# Altium schematic sheet P14 Hi3519 Peripheral.SchDoc
size 420 x 297 mm
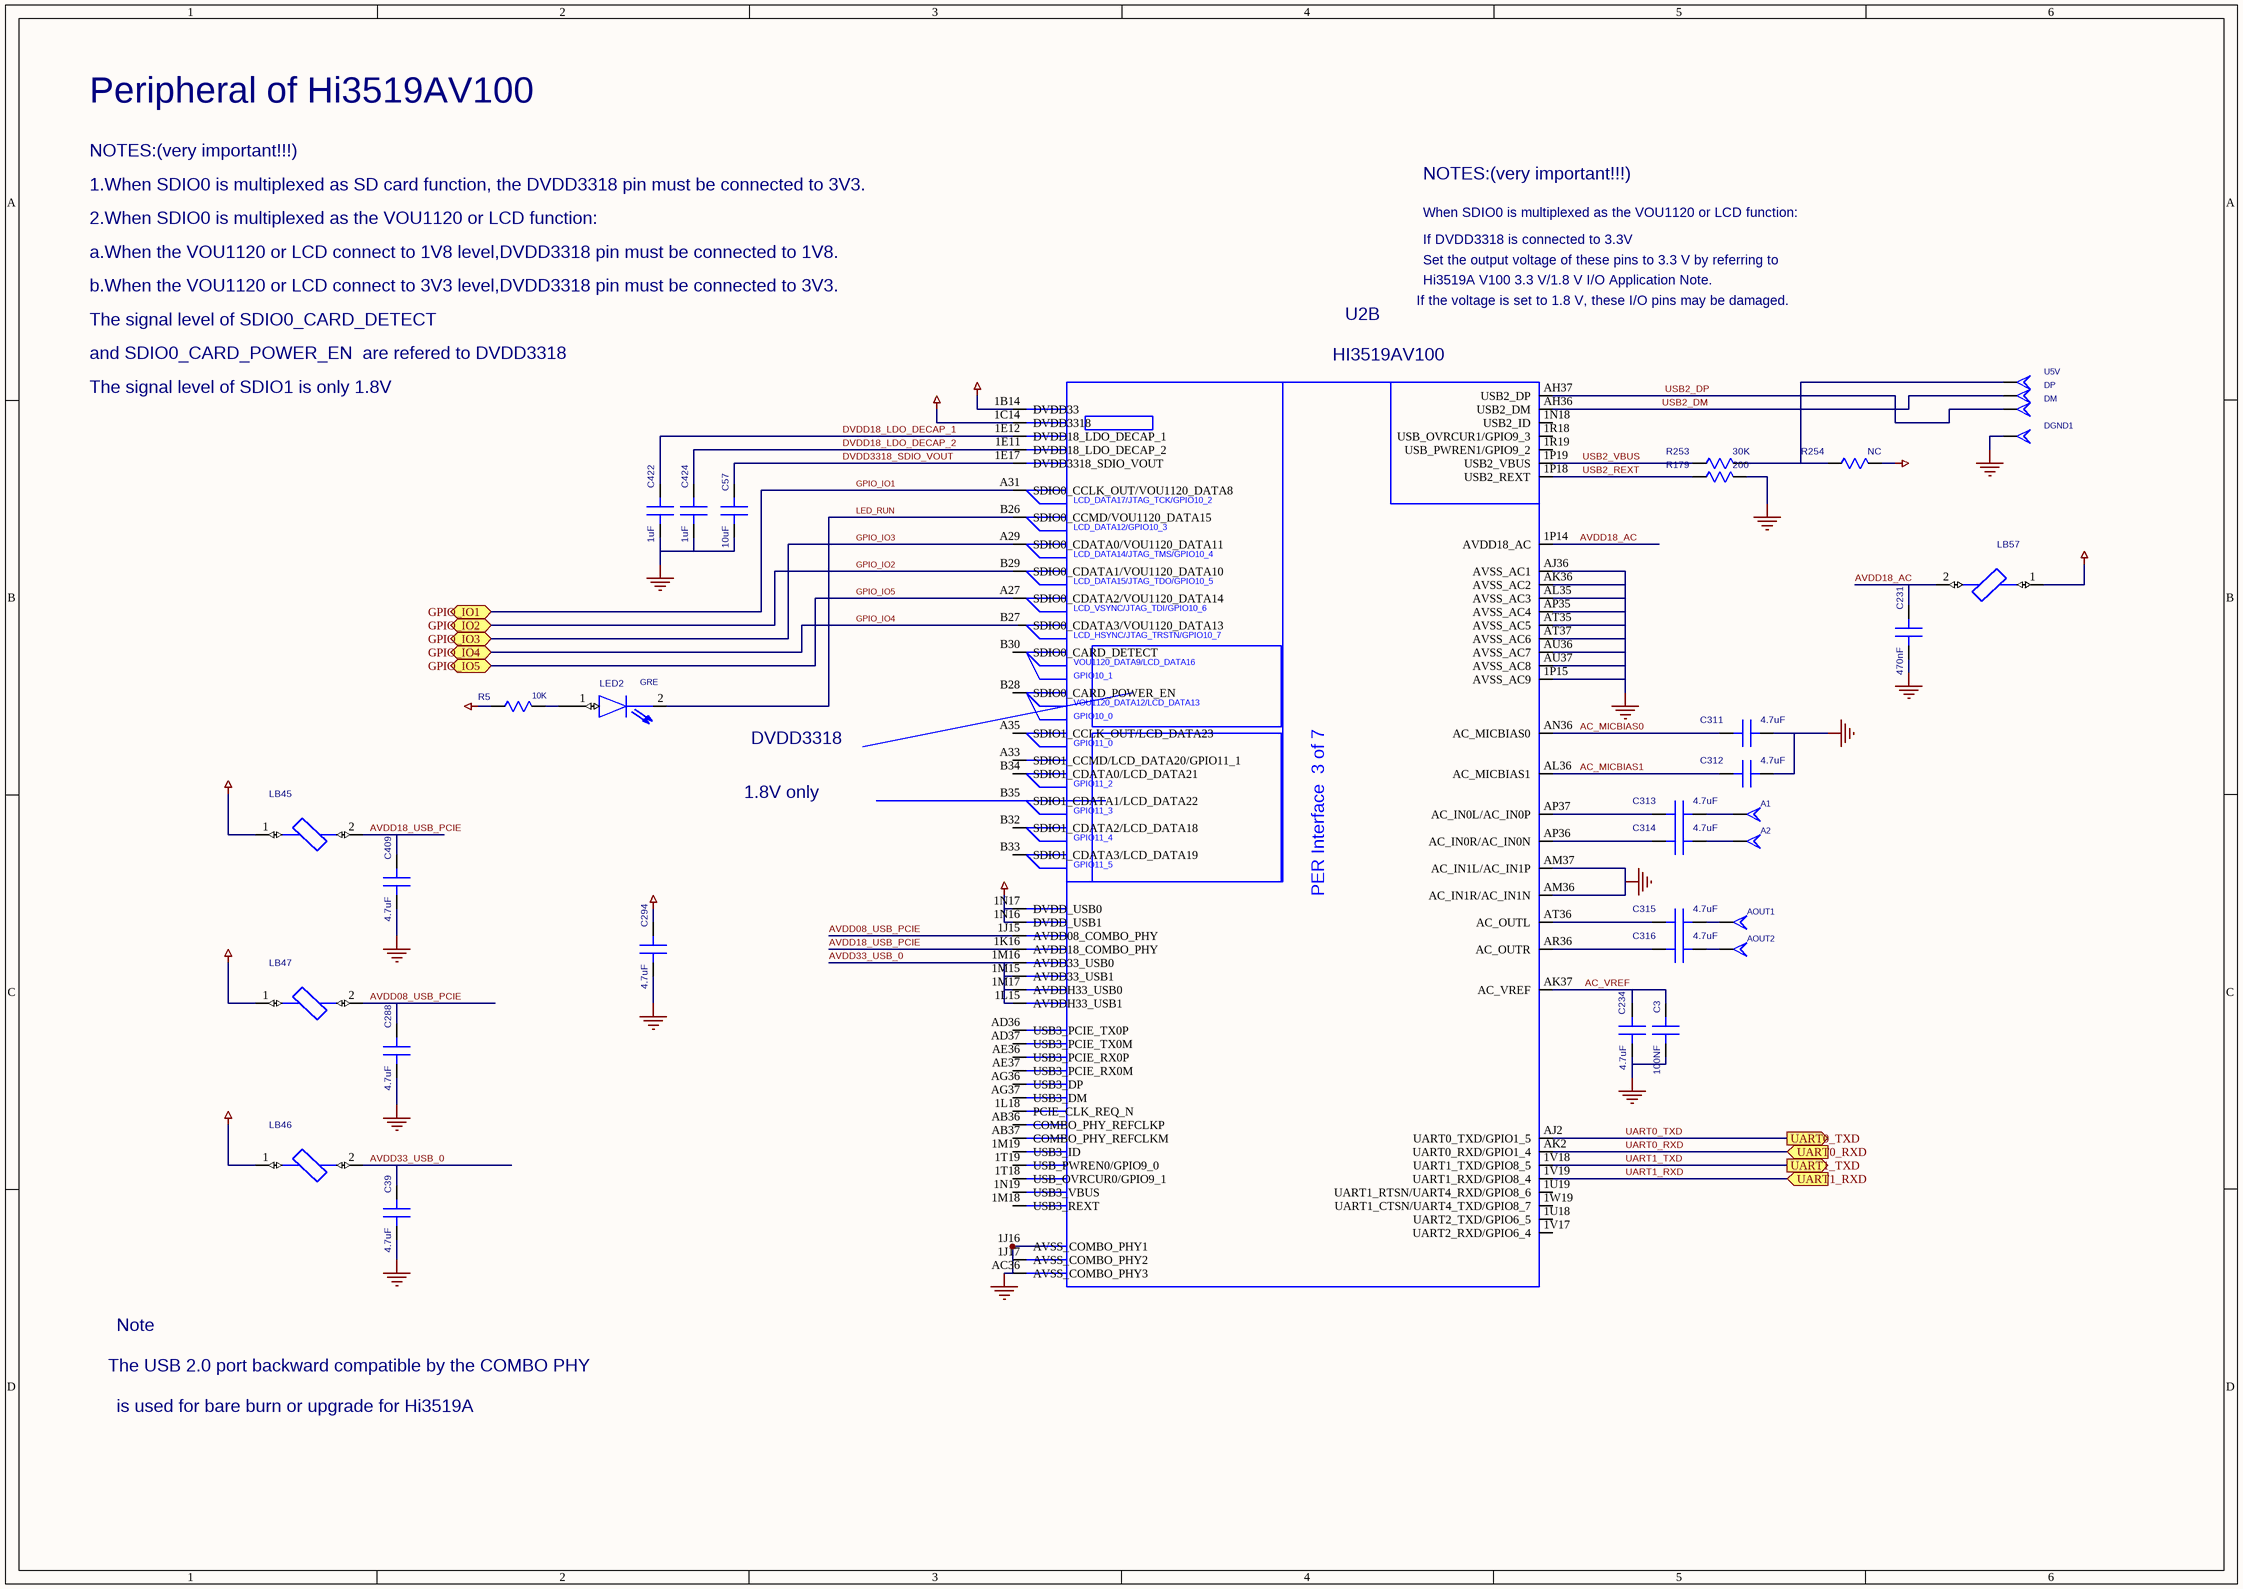
[diagram p0: P14 Hi3519 Peripheral.SchDoc]

## Parts
A1  T POINT A  [PAD]  (value not drawn)
A2  T POINT A  [PAD]  (value not drawn)
AOUT1  T POINT A  [PAD]  (value not drawn)
AOUT2  T POINT A  [PAD]  (value not drawn)
C3  100NF  [SC0402-BGA]
C39  4.7uF  [SC0402-BGA]
C57  10uF  [SC0603]
C231  470nF  [SC0402-BGA]
C234  4.7uF  [SC0402-BGA]
C288  4.7uF  [SC0402-BGA]
C294  4.7uF  [SC0402-BGA]
C311  4.7uF  [SC0402-BGA]
C312  4.7uF  [SC0402-BGA]
C313  4.7uF  [SC0402-BGA]
C314  4.7uF  [SC0402-BGA]
C315  4.7uF  [SC0402-BGA]
C316  4.7uF  [SC0402-BGA]
C409  4.7uF  [SC0402-BGA]
C422  1uF  [SC0402-BGA]
C424  1uF  [SC0402-BGA]
DGND1  T POINT A  [PAD]  (value not drawn)
DM  T POINT A  [PAD]  (value not drawn)
DP  T POINT A  [PAD]  (value not drawn)
LB45  LB  [SL0402]  (value not drawn)
LB46  LB  [SL0402]  (value not drawn)
LB47  LB  [SL0402]  (value not drawn)
LB57  LB  [SL0402]  (value not drawn)
LED2  GRE  [HSD0603-LED]
R5  10K  [SR0603]
R179  200  [SR0402]
R253  30K  [SR0402]
R254  NC  [SR0402]
U2  DEVICE: HI3519AV100  [HBGA567-16-3737]  (hidden comment: HI3519A_VO)  (part B of 7)
U5V  T POINT A  [PAD]  (value not drawn)

## Ports
GPIO_IO1, GPIO_IO2, GPIO_IO3, GPIO_IO4, GPIO_IO5, UART0_RXD, UART0_TXD, UART1_RXD, UART1_TXD

## Nets
0V8_LDO: LB47.1
1V8: LB45.1 LB57.1
3V3: LB46.1 R5.1(A) R254.2(B) U2.1B14(DVDD33) U2.1C14(DVDD3318)
DVDD: C294.1(A) U2.1N16(DVDD_USB1) U2.1N17(DVDD_USB0)
GND: C3.2(B) C39.2(B) C57.2(B) C231.2(B) C234.2(B) C288.2(B) C294.2(B) C311.2(B) C312.2(B) C409.2(B) C422.2(B) C424.2(B) DGND1.1(TP) R179.2(B) U2.1J16(AVSS_COMBO_PHY1) U2.1J17(AVSS_COMBO_PHY2) U2.1P15(AVSS_AC9) U2.AC36(AVSS_COMBO_PHY3) U2.AJ36(AVSS_AC1) U2.AK36(AVSS_AC2) U2.AL35(AVSS_AC3) U2.AM36(AC_IN1R/AC_IN1N) U2.AM37(AC_IN1L/AC_IN1P) U2.AP35(AVSS_AC4) U2.AT35(AVSS_AC5) U2.AT37(AVSS_AC6) U2.AU36(AVSS_AC7) U2.AU37(AVSS_AC8)
AC_MICBIAS0: C311.1(A) U2.AN36(AC_MICBIAS0)
AC_MICBIAS1: C312.1(A) U2.AL36(AC_MICBIAS1)
AC_VREF: C3.1(A) C234.1(A) U2.AK37(AC_VREF)
AVDD08_USB_PCIE: C288.1(A) LB47.2 U2.1J15(AVDD08_COMBO_PHY)
AVDD18_AC: C231.1(A) LB57.2 U2.1P14(AVDD18_AC)
AVDD18_USB_PCIE: C409.1(A) LB45.2 U2.1K16(AVDD18_COMBO_PHY)
AVDD33_USB_0: C39.1(A) LB46.2 U2.1L15(AVDDH33_USB1) U2.1M15(AVDD33_USB1) U2.1M16(AVDD33_USB0) U2.1M17(AVDDH33_USB0)
DVDD18_LDO_DECAP_1: C422.1(A) U2.1E12(DVDD18_LDO_DECAP_1)
DVDD18_LDO_DECAP_2: C424.1(A) U2.1E11(DVDD18_LDO_DECAP_2)
DVDD3318_SDIO_VOUT: C57.1(A) U2.1E17(DVDD3318_SDIO_VOUT)
GPIO_IO1: U2.A31(SDIO0_CCLK_OUT/VOU1120_DATA8) ; port GPIO_IO1
GPIO_IO2: U2.B29(SDIO0_CDATA1/VOU1120_DATA10) ; port GPIO_IO2
GPIO_IO3: U2.A29(SDIO0_CDATA0/VOU1120_DATA11) ; port GPIO_IO3
GPIO_IO4: U2.B27(SDIO0_CDATA3/VOU1120_DATA13) ; port GPIO_IO4
GPIO_IO5: U2.A27(SDIO0_CDATA2/VOU1120_DATA14) ; port GPIO_IO5
LED_RUN: LED2.2(B) U2.B26(SDIO0_CCMD/VOU1120_DATA15)
UART0_RXD: U2.AK2(UART0_RXD/GPIO1_4) ; port UART0_RXD
UART0_TXD: U2.AJ2(UART0_TXD/GPIO1_5) ; port UART0_TXD
UART1_RXD: U2.1V19(UART1_RXD/GPIO8_4) ; port UART1_RXD
UART1_TXD: U2.1V18(UART1_TXD/GPIO8_5) ; port UART1_TXD
USB2_DM: DP.1(TP) U2.AH36(USB2_DM)
USB2_DP: DM.1(TP) U2.AH37(USB2_DP)
USB2_REXT: R179.1(A) U2.1P18(USB2_REXT)
USB2_VBUS: R253.1(A) U2.1P19(USB2_VBUS)
NetA1_1: A1.1(TP) C313.2(B)
NetA2_1: A2.1(TP) C314.2(B)
NetAOUT1_1: AOUT1.1(TP) C315.2(B)
NetAOUT2_1: AOUT2.1(TP) C316.2(B)
NetC313_1: C313.1(A) U2.AP37(AC_IN0L/AC_IN0P)
NetC314_1: C314.1(A) U2.AP36(AC_IN0R/AC_IN0N)
NetC315_1: C315.1(A) U2.AT36(AC_OUTL)
NetC316_1: C316.1(A) U2.AR36(AC_OUTR)
NetLED2_1: LED2.1(A) R5.2(B)
NetR253_2: R253.2(B) R254.1(A) U5V.1(TP)

Not connected (* = marked no-connect by the designer): U2 1L18(PCIE_CLK_REQ_N) 1M18(USB3_REXT) 1M19(USB3_ID) 1N18(USB2_ID) 1N19(USB3_VBUS) 1R18(USB_OVRCUR1/GPIO9_3) 1R19(USB_PWREN1/GPIO9_2) 1T18(USB_OVRCUR0/GPIO9_1) 1T19(USB_PWREN0/GPIO9_0) 1U18(UART2_TXD/GPIO6_5) 1U19(UART1_RTSN/UART4_RXD/GPIO8_6) 1V17(UART2_RXD/GPIO6_4) 1W19(UART1_CTSN/UART4_TXD/GPIO8_7) A33(SDIO1_CCMD/LCD_DATA20/GPIO11_1) A35(SDIO1_CCLK_OUT/LCD_DATA23) AB36(COMBO_PHY_REFCLKP) AB37(COMBO_PHY_REFCLKM) AD36(USB3_PCIE_TX0P) AD37(USB3_PCIE_TX0M) AE36(USB3_PCIE_RX0P) AE37(USB3_PCIE_RX0M) AG36(USB3_DP) AG37(USB3_DM) B28(SDIO0_CARD_POWER_EN) B30(SDIO0_CARD_DETECT) B32(SDIO1_CDATA2/LCD_DATA18) B33(SDIO1_CDATA3/LCD_DATA19) B34(SDIO1_CDATA0/LCD_DATA21) B35(SDIO1_CDATA1/LCD_DATA22)

## Notes on the sheet
- Peripheral of Hi3519AV100
- 1.When SDIO0 is multiplexed as SD card function, the DVDD3318 pin must be connected to 3V3.
- NOTES:(very important!!!)
- 2.When SDIO0 is multiplexed as the VOU1120 or LCD function:
- a.When the VOU1120 or LCD connect to 1V8 level,DVDD3318 pin must be connected to 1V8.
- If DVDD3318 is connected to 3.3V
- When SDIO0 is multiplexed as the VOU1120 or LCD function:
- b.When the VOU1120 or LCD connect to 3V3 level,DVDD3318 pin must be connected to 3V3.
- The signal level of SDIO0_CARD_DETECT
- If the voltage is set to 1.8 V, these I/O pins may be damaged.
- Hi3519A V100 3.3 V/1.8 V I/O Application Note.
- Set the output voltage of these pins to 3.3 V by referring to
- and SDIO0_CARD_POWER_EN  are refered to DVDD3318
- The signal level of SDIO1 is only 1.8V
- 1.8V only
- DVDD3318
- Note
- The USB 2.0 port backward compatible by the COMBO PHY
- is used for bare burn or upgrade for Hi3519A
- (in symbol HI3519A_VO_5, part B) LCD_DATA17/JTAG_TCK/GPIO10_2; LCD_DATA12/GPIO10_3; LCD_DATA14/JTAG_TMS/GPIO10_4; LCD_DATA15/JTAG_TDO/GPIO10_5; LCD_VSYNC/JTAG_TDI/GPIO10_6; LCD_HSYNC/JTAG_TRSTN/GPIO10_7; VOU1120_DATA9/LCD_DATA16; GPIO10_1; VOU1120_DATA12/LCD_DATA13; GPIO10_0; GPIO11_0; GPIO11_2; GPIO11_3; GPIO11_4; GPIO11_5; PER Interface  3 of 7

## Library data of the parts
C3 = C: PARTS: 1; OriginalSymbolOrigin: (0,0); DEVICE: RMEMK105BJ104KV_FR; LEVEL: STD; PINSWAP: (A,B); CODE: 8070614; %195%%232%%202%%246%: SMD陶瓷电容-16V-100nF-+/-10%-X7R-0402-BT; %182%%238%%182%%168%%185%%164%%215%%247%%181%%231%%209%%185%(V): 16; COMPONENT_HIGH_MAX: 0.55MM; %208%%161%%192%%224%%195%%251%%179%%198%: SMD陶瓷电容; PKG_TYPE: SC0402-BGA
C39 C294 C312-C316 C409 = C: PARTS: 1; OriginalSymbolOrigin: (0,0); DEVICE: CM05X6T475M06AH-HW; LEVEL: STD; PINSWAP: (A,B); %208%%161%%192%%224%%195%%251%%179%%198%: SMD陶瓷电容; COMPONENT_HIGH_MAX: -999999mm; %182%%238%%182%%168%%185%%164%%215%%247%%181%%231%%209%%185%(V): 6.3; %195%%232%%202%%246%: SMD陶瓷电容-6.3V-4700nF-+/-20%-X6T-0402-华技终端专用; CODE: 8072081; PKG_TYPE: SC0402-BGA
C57 = C: PARTS: 1; OriginalSymbolOrigin: (0,0); DEVICE: C1608X7S0J106MT000E; LEVEL: STD; PINSWAP: (A,B); CODE: 8071624; %195%%232%%202%%246%: SMD陶瓷电容-6.3V-10000nF-+/-20%-X7T-0603; %182%%238%%182%%168%%185%%164%%215%%247%%181%%231%%209%%185%(V): 6.3; COMPONENT_HIGH_MAX: 1mm; %208%%161%%192%%224%%195%%251%%179%%198%: SMD陶瓷电容; PKG_TYPE: SC0603
C231 = C: PARTS: 1; OriginalSymbolOrigin: (0,0); DEVICE: GRM155R71A474KE01D; LEVEL: STD; PINSWAP: (A,B); %208%%161%%192%%224%%195%%251%%179%%198%: SMD陶瓷电容; %195%%232%%202%%246%: SMD陶瓷电容-6.3V-470nF-+/-10%-X7R-0402; CODE: 8072110; COMPONENT_HIGH_MAX: -999999mm; %182%%238%%182%%168%%185%%164%%215%%247%%181%%231%%209%%185%(V): 6.3; PKG_TYPE: SC0402-BGA
C234 C288 C311 = C: PARTS: 1; OriginalSymbolOrigin: (0,0); DEVICE: CM05X6T475M06AH-HW; LEVEL: STD; PINSWAP: (A,B); CODE: 8072081; %195%%232%%202%%246%: SMD陶瓷电容-6.3V-4700nF-+/-20%-X6T-0402-华技终端专用; %182%%238%%182%%168%%185%%164%%215%%247%%181%%231%%209%%185%(V): 6.3; COMPONENT_HIGH_MAX: -999999mm; %208%%161%%192%%224%%195%%251%%179%%198%: SMD陶瓷电容; PKG_TYPE: SC0402-BGA
C422 C424 = C: PARTS: 1; OriginalSymbolOrigin: (0,0); DEVICE: C1005X6S1A105KT000F; LEVEL: STD; PINSWAP: (A,B); CODE: 8071747; %195%%232%%202%%246%: SMD陶瓷电容-10V-1000nF-+/-10%-X6S-0402; %182%%238%%182%%168%%185%%164%%215%%247%%181%%231%%209%%185%(V): 10; COMPONENT_HIGH_MAX: 0.6mm; %208%%161%%192%%224%%195%%251%%179%%198%: SMD陶瓷电容; PKG_TYPE: SC0402-BGA
LB45 LB46 LB57 = LB_Dup1: PARTS: 1; OriginalSymbolOrigin: (0,0); LEVEL: STD; DEVICE: BLM15BD601SN1D; %208%%161%%192%%224%%195%%251%%179%%198%: EMI磁珠; COMPONENT_HIGH_MAX: 0.55MM; %195%%232%%202%%246%: EMI磁珠-+/-25%-600ohm-0.65ohm-0.2A-402; CODE: 10070013; PKG_TYPE: SL0402
LB47 = LB_Dup1: PARTS: 1; OriginalSymbolOrigin: (0,0); LEVEL: STD; DEVICE: BLM15BD601SN1D; CODE: 10070013; %195%%232%%202%%246%: EMI磁珠-+/-25%-600ohm-0.65ohm-0.2A-402; COMPONENT_HIGH_MAX: 0.55MM; %208%%161%%192%%224%%195%%251%%179%%198%: EMI磁珠; PKG_TYPE: SL0402
LED2 = LED: PARTS: 1; OriginalSymbolOrigin: (0,0); CODE: 15020150; DEVICE: 19_218_R6C_FM2P1B7Y_3THW; LEVEL: STD; COMPONENT_HIGH_MAX: 0.35MM; %195%%232%%202%%246%: 发光二极管-0.0225CD-红色/630NM-20MA-0603-华技终端专用; %208%%161%%192%%224%%195%%251%%179%%198%: 发光二极管; PKG_TYPE: HSD0603-LED
R5 = R_Dup1: PARTS: 1; OriginalSymbolOrigin: (0,0); PINSWAP: (A,B); DEVICE: RC0603JR_07470R; LEVEL: STD; %195%%232%%202%%246%: 片式厚膜电阻器-0.1W-470OHM-+/-5%-0603; CODE: 7090275; %182%%238%%182%%168%%185%%166%%194%%202%(W): 0.1; %215%%232%%214%%181%%212%%202%%208%%237%%198%%171%%178%%238%: +/-5%; COMPONENT_HIGH_MAX: 0.55MM; %208%%161%%192%%224%%195%%251%%179%%198%: 片式厚膜电阻器; PKG_TYPE: SR0603
R179 = R_Dup1: PARTS: 1; OriginalSymbolOrigin: (0,0); PINSWAP: (A,B); DEVICE: RN731ETTP2000B50; LEVEL: STD; CODE: 7110054; %195%%232%%202%%246%: 片式薄膜电阻器-0.0625W-200ohm-+/-0.1%-0402-+/-50ppm/degC; %182%%238%%182%%168%%185%%166%%194%%202%(W): 0.06; %215%%232%%214%%181%%212%%202%%208%%237%%198%%171%%178%%238%: +/-0.1%; %208%%161%%192%%224%%195%%251%%179%%198%: 片式薄膜电阻器; PKG_TYPE: SR0402
R253 R254 = R_Dup1: PARTS: 1; OriginalSymbolOrigin: (0,0); PINSWAP: (A,B); DEVICE: RC_02W303FT; LEVEL: STD; CODE: 7090892; %195%%232%%202%%246%: 片式厚膜电阻器-0.0625W-30000ohm-+/-1%-0402; %182%%238%%182%%168%%185%%166%%194%%202%(W): 0.06; %215%%232%%214%%181%%212%%202%%208%%237%%198%%171%%178%%238%: +/-1%; COMPONENT_HIGH_MAX: 0.4MM; %208%%161%%192%%224%%195%%251%%179%%198%: 片式厚膜电阻器; PKG_TYPE: SR0402
U2 = HI3519A_VO_5: PARTS: 1; OriginalSymbolOrigin: (0,0); LEVEL: STD; HETERO: (HI3519A_DDR),(HI3519A_MIPI),(HI3519A_PER),(HI3519A_SYS),(HI3519A_VO),(HI3519A_PWR),(HI3519A_VSS); CaptureCellPackProp: HI3519A_VOB; PKG_TYPE: HBGA567-16-3737